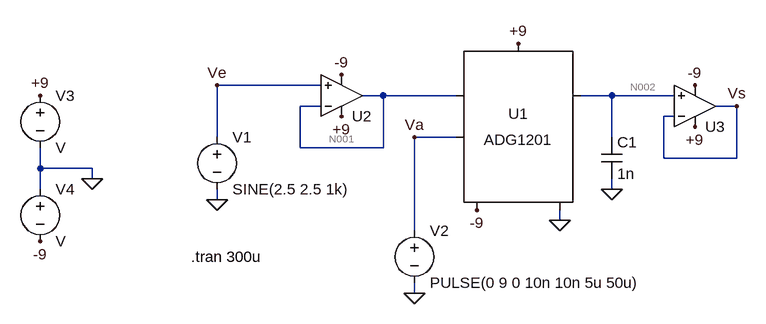
[diagram p0: schematic Lab4.asc]
Lab4.asc, the LTspice schematic file:
Version 4
SHEET 1 880 680
WIRE -96 112 -256 112
WIRE 0 128 -32 128
WIRE 112 128 0 128
WIRE 352 128 304 128
WIRE 448 128 352 128
WIRE -96 144 -128 144
WIRE 544 144 512 144
WIRE 448 160 432 160
WIRE -256 192 -256 112
WIRE 112 192 48 192
WIRE 352 192 352 128
WIRE -128 208 -128 144
WIRE 0 208 0 128
WIRE 0 208 -128 208
WIRE 432 224 432 160
WIRE 544 224 544 144
WIRE 544 224 432 224
WIRE -528 240 -528 208
WIRE -448 240 -528 240
WIRE -448 256 -448 240
WIRE -528 272 -528 240
WIRE 352 272 352 256
WIRE -256 288 -256 272
WIRE 272 320 272 304
WIRE 48 336 48 192
WIRE 48 432 48 416
FLAG -64 96 -9
FLAG -64 160 +9
FLAG -256 288 0
FLAG 48 432 0
FLAG 144 304 -9
FLAG 272 320 0
FLAG 208 48 +9
FLAG 480 112 -9
FLAG 480 176 +9
FLAG 352 272 0
FLAG -448 256 0
FLAG -528 128 +9
FLAG -528 352 -9
FLAG 48 192 Va
FLAG -256 112 Ve
FLAG 544 144 Vs
SYMBOL Switches\\ADG1201 208 176 R0
SYMATTR InstName U1
SYMBOL OpAmps\\UniversalOpAmp -64 128 M180
SYMATTR InstName U2
SYMBOL voltage -256 176 R0
WINDOW 123 0 0 Left 0
WINDOW 39 0 0 Left 0
SYMATTR InstName V1
SYMATTR Value SINE(2.5 2.5 1k)
SYMBOL voltage 48 320 R0
WINDOW 123 0 0 Left 0
WINDOW 39 0 0 Left 0
SYMATTR InstName V2
SYMATTR Value PULSE(0 9 0 10n 10n 5u 50u)
SYMBOL cap 336 192 R0
SYMATTR InstName C1
SYMATTR Value 1n
SYMBOL voltage -528 112 R0
SYMATTR InstName V3
SYMBOL voltage -528 256 R0
SYMATTR InstName V4
SYMBOL OpAmps\\UniversalOpAmp 480 144 M180
SYMATTR InstName U3
TEXT -296 376 Left 2 !.tran 300u

The netlist it stands for:
* Lab4.asc
XU1 Va N002 N001 -9 0 +9 ADG1201
XU2 Ve N001 +9 -9 N001 level1 Avol=1Meg GBW=10Meg Vos=0 En=0 Enk=0 In=0 Ink=0 Rin=500Meg  ; pins In+ In- V+ V- OUT
V1 Ve 0 SINE(2.5 2.5 1k)
V2 Va 0 PULSE(0 9 0 10n 10n 5u 50u)
C1 N002 0 1n
V3 +9 0 V
V4 0 -9 V
XU3 N002 Vs +9 -9 Vs level1 Avol=1Meg GBW=10Meg Vos=0 En=0 Enk=0 In=0 Ink=0 Rin=500Meg  ; pins In+ In- V+ V- OUT
.tran 300u
.lib ADG1201.sub
.lib UniversalOpAmp1.lib
.backanno
.end

* Results of the author's LTspice run, read from the files saved beside the schematic
* Operating Point, zero values left out:
*   V(n001) = 2.5 V
*   V(n002) = 489.9 mV
*   V(ve) = 2.5 V
*   V(vs) = 489.9 mV
*   I(V1) = -5 nA
*   I(V3) = 392.7 mA
*   I(V4) = -8.97 nA
*   Ix(u1:2) = -975.9 pA
*   Ix(u1:3) = 392.7 mA
*   Ix(u1:4) = -2.99 nA
*   Ix(u1:6) = -392.7 mA
*   Ix(u2:1) = 5 nA
*   Ix(u2:2) = 5 nA
*   Ix(u2:3) = -5 nA
*   Ix(u2:4) = -5 nA
*   Ix(u2:5) = -392.7 mA
*   Ix(u3:1) = 979.8 pA
*   Ix(u3:2) = 979.8 pA
*   Ix(u3:3) = -979.8 pA
*   Ix(u3:4) = -979.8 pA
*   Ix(u3:5) = 585.1 pA
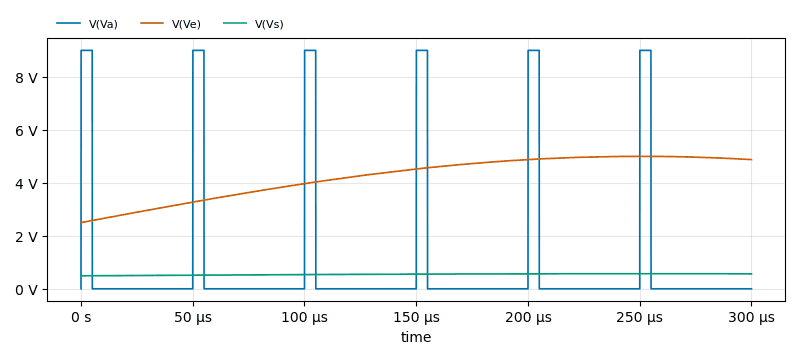
[diagram p1: Transient Analysis of Lab4.asc, plotted from the saved traces]
* Transient Analysis, 1 run:
*   V(Va): min 0 V, max 9 V, average 901.8 mV, rms 2.848 V, last 0 V
*   V(Ve): min 2.5 V, max 5 V, average 4.235 V, rms 4.306 V, last 4.878 V
*   V(Vs): min 489.9 mV, max 569.3 mV, average 544.9 mV, rms 545.4 mV, last 565.4 mV